# EAGLE schematic cp2102_esp32 (EAGLE 9.6.2)
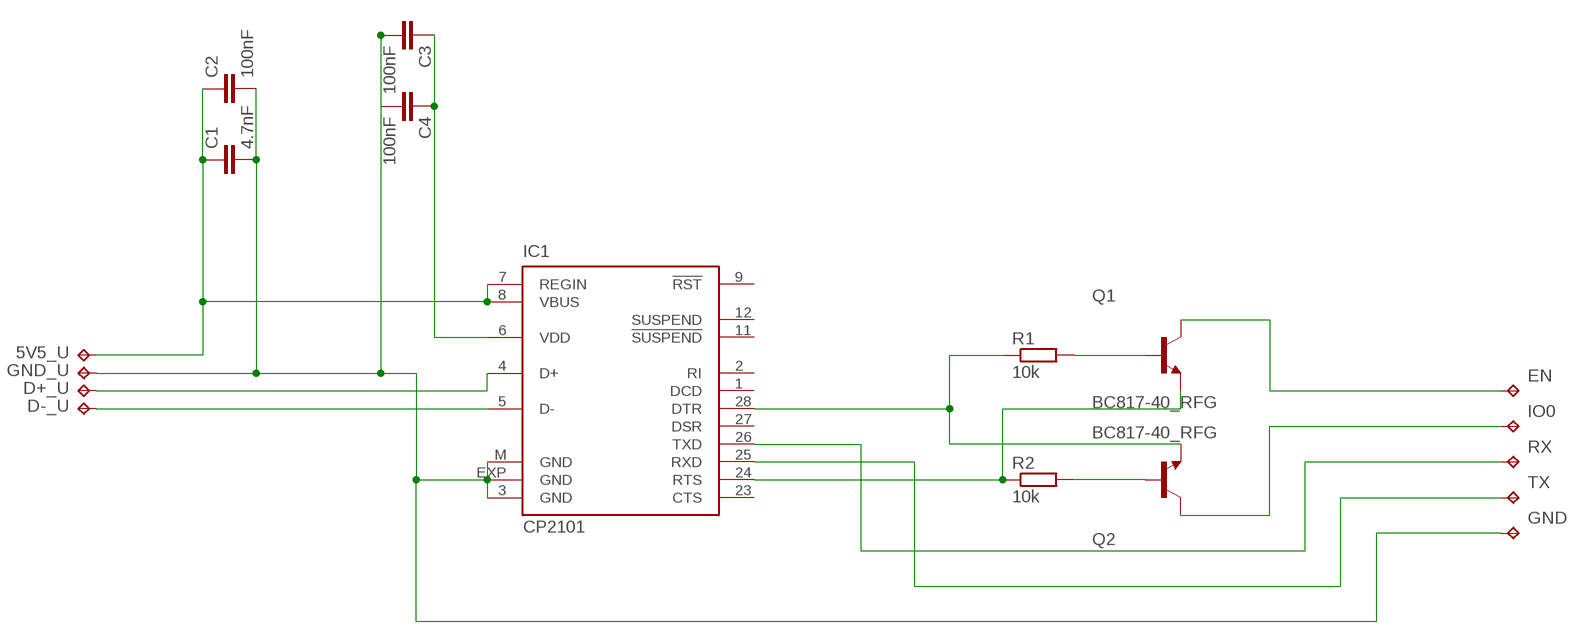
[diagram p0: schematic, sheet 1]

## Parts
5V5_U  TPB1,27  [B1,27]
C1  4.7nF  C-EUC0603  [C0603]
C2  100nF  C-EUC0603  [C0603]
C3  100nF  C-EUC0603  [C0603]
C4  100nF  C-EUC0603  [C0603]
D+_U  TPB1,27  [B1,27]
D-_U  TPB1,27  [B1,27]
EN  TPB1,27  [B1,27]
GND  TPB1,27  [B1,27]
GND_U  TPB1,27  [B1,27]
IC1  CP2101  [MLP28]
IO0  TPB1,27  [B1,27]
Q1  BC817-40_RFG  [SOT95P237X112-3N]
Q2  BC817-40_RFG  [SOT95P237X112-3N]
R1  10k  R-EU_R0603  [R0603]
R2  10k  R-EU_R0603  [R0603]
RX  TPB1,27  [B1,27]
TX  TPB1,27  [B1,27]

## Nets
N$1: C3.1 C4.1 IC1.6(VDD)
N$3: IC1.26(TXD) RX.TP
N$4: IC1.25(RXD) TX.TP
N$5: D+_U.TP IC1.4(D+)
N$6: D-_U.TP IC1.5(D-)
N$7: IC1.28(DTR) Q2.2(E) R1.1
N$8: 5V5_U.TP C1.1 C2.1 IC1.7(REGIN) IC1.8(VBUS)
N$9: IC1.24(RTS) Q1.2(E) R2.1
N$10: C1.2 C2.2 C3.2 C4.2 GND.TP GND_U.TP IC1.3(GND) IC1.EXP(GND) IC1.M(GND)
N$11: IO0.TP Q2.3(C)
N$13: Q2.1(B) R2.2
N$14: Q1.1(B) R1.2
N$15: EN.TP Q1.3(C)
Unconnected: IC1.1(DCD) IC1.2(RI) IC1.9(!RST) IC1.11(!SUSPEND) IC1.12(SUSPEND) IC1.23(CTS) IC1.27(DSR)

## Library data of the parts
5V5_U D+_U D-_U EN GND GND_U IO0 RX TX = testpad:TP: Test pad
C1-C4 = rcl:C-EU: CAPACITOR, European symbol; SPICEPREFIX: C
IC1 = silabs:CP210*: Single-Chip USB to UART Bridge Source: www.silabs.com .. CP2101.pdf / cp2102.pdf; MF: FARNELL; MPN: CP2102-GM; OC_FARNELL: 9282130; OC_NEWARK: 30K5635
Q1 Q2 = BC817-40_RFG:BC817-40_RFG: Bipolar (BJT) Transistor NPN 65 V 100 mA 100MHz 200 mW Surface Mount SOT-23 Check availability <https://pricing.snapeda.com/parts/BC817-40%20RFG/Taiwan%20Semiconductor/view-part?ref=eda>; AVAILABILITY: In Stock; DESCRIPTION: SOT-23, 50V, 0.5A, NPN Bipolar Transistor; MF: Taiwan Semiconductor; MP: BC817-40 RFG; PACKAGE: SOT-23 Taiwan Semiconductor; PRICE: None; PURCHASE-URL: https://pricing.snapeda.com/search/part/BC817-40 RFG/?ref=eda
R1 R2 = rcl:R-EU_: RESISTOR, European symbol; SPICEPREFIX: R